# Altium schematic sheet Atmega-SolderingStation-v2.7_2025-10-03.schdoc
size 354 x 214 mm
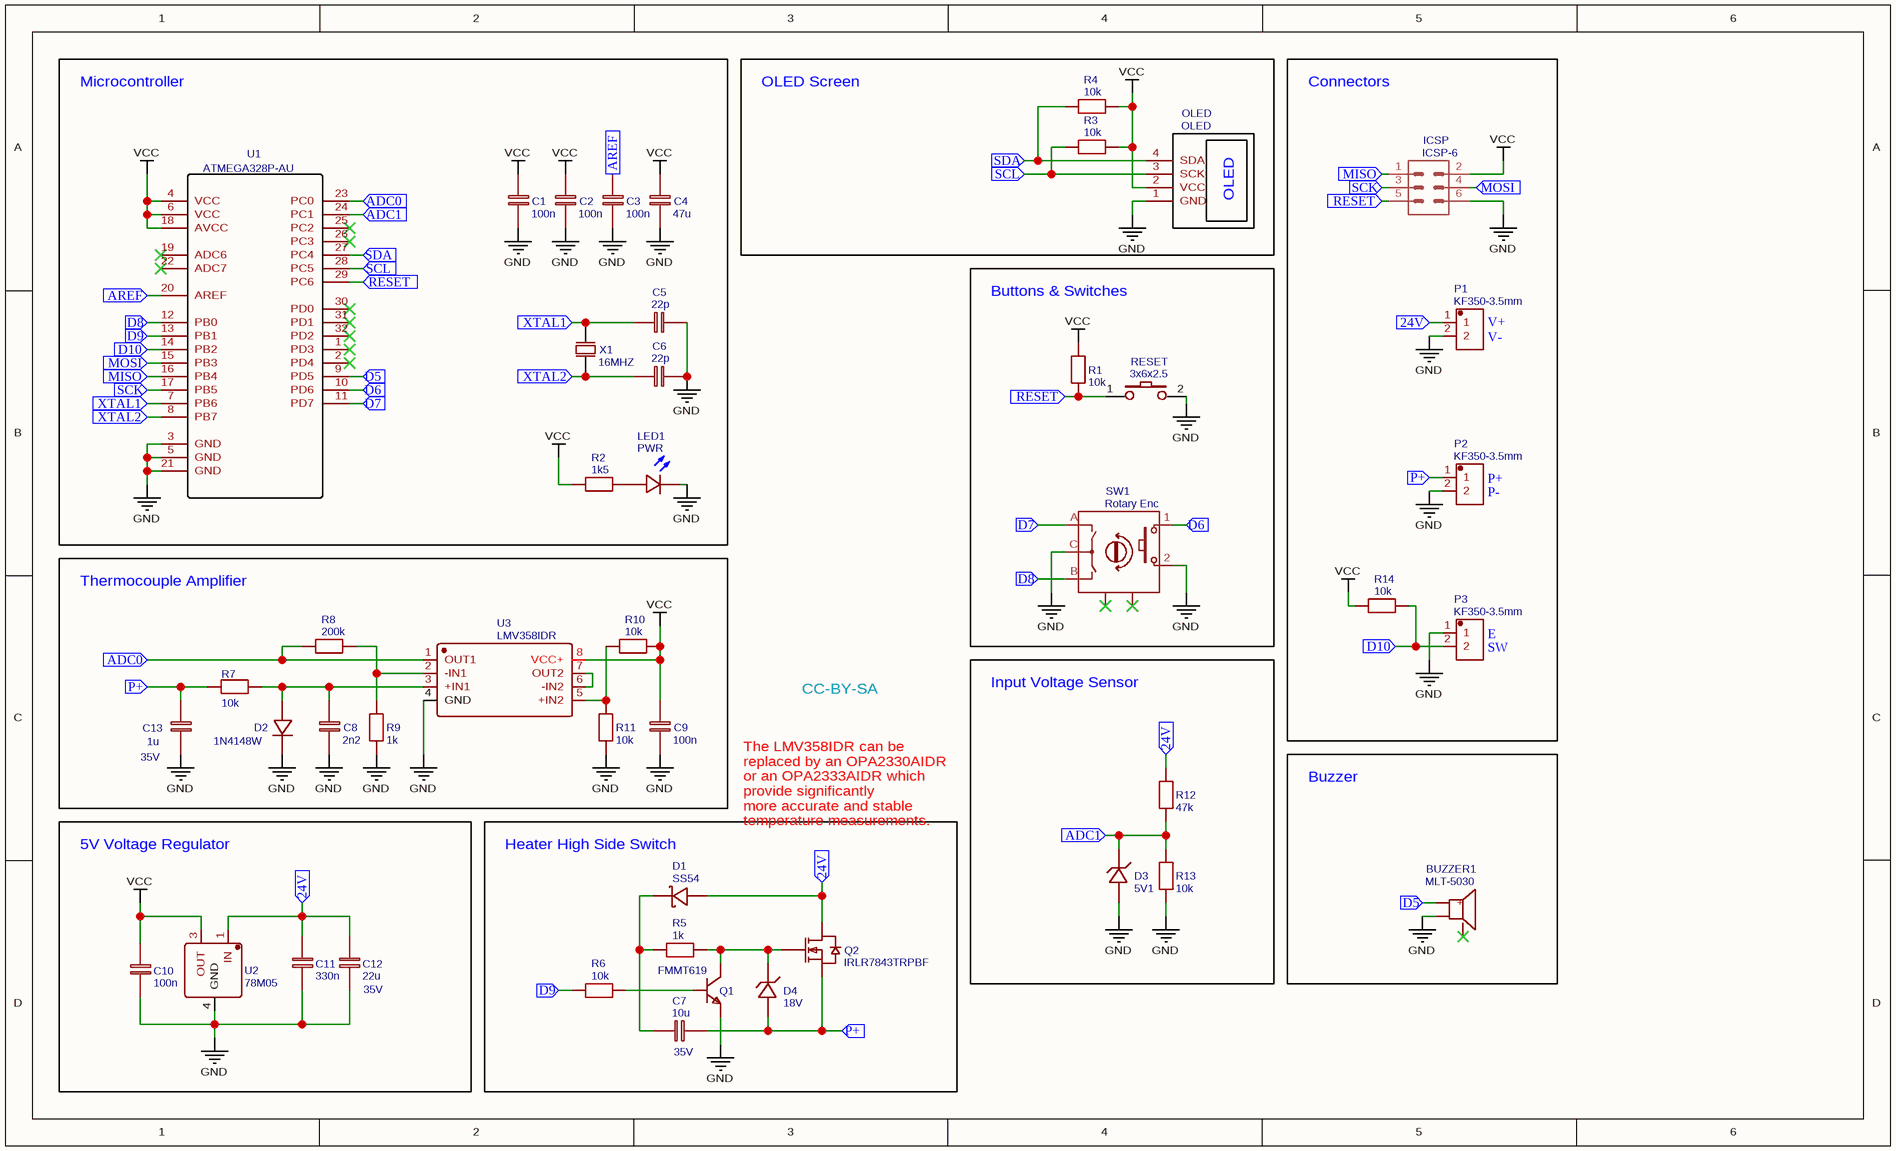
[diagram p0: Atmega-SolderingStation-v2.7_2025-10-03.schdoc]

## Parts
BUZZER1  MLT-5030  [MLT-5030]
C1  100n  [0603]
C2  100n  [0603]
C3  100n  [0603]
C4  47u  [1206]
C5  22p  [0603]
C6  22p  [0603]
C7  10u  [1206]
C8  2n2  [0603]
C9  100n  [0603]
C10  100n  [0603]
C11  330n  [0603]
C12  22u  [1206]
C13  1u  [0603]
D1  SS54  [DIODE-SMA(DO-214AC)]
D2  1N4148W  [DIODE-SOD-123]
D3  5V1  [ZENER-SOD-123]
D4  18V  [ZENER-SOD-123]
ICSP  ICSP-6  [ICSP-6]
LED1  PWR  [LED0603]
OLED  OLED  [I2C - OLED 0.96" 128X64]
P1  KF350-3.5mm  [KF350-2P]
P2  KF350-3.5mm  [KF350-2P]
P3  KF350-3.5mm  [KF350-2P]
Q1  FMMT619  [SOT-23-3_L2.9-W1.6-P1.90-LS2.8-BR]
Q2  IRLR7843TRPBF  [TO-252-2]
R1  10k  [0603]
R2  1k5  [0603]
R3  10k  [0603]
R4  10k  [0603]
R5  1k  [1206]
R6  10k  [0603]
R7  10k  [0603]
R8  200k  [0603]
R9  1k  [0603]
R10  10k  [0603]
R11  10k  [0603]
R12  47k  [0603]
R13  10k  [0603]
R14  10k  [0603]
RESET  3x6x2.5  [KEY-3.0*6.0]
SW1  Rotary Enc  [BOURNS_PEC11R-4XXXF-SXXXX]
U1  ATMEGA328P-AU  [TQFP-32_7X7X08P]
U2  78M05  [TO-252-2]
U3  LMV358IDR  [SOP-8_150MIL]
X1  16MHZ  [HC-49S]

## Blocks framed on the sheet
Microcontroller: C1-C6 LED1 R2 U1 X1
OLED Screen: OLED R3 R4
Connectors: ICSP P1-P3 R14
Buttons & Switches: R1 RESET SW1
Thermocouple Amplifier: C8 C9 C13 D2 R7-R11 U3
Input Voltage Sensor: D3 R12 R13
Buzzer: BUZZER1
5V Voltage Regulator: C10-C12 U2
Heater High Side Switch: C7 D1 D4 Q1 Q2 R5 R6

## Ports
24V (in), ADC0 (in), ADC1 (in), AREF (in), D5 (in), D6 (in), D7 (in), D8 (in), D9 (in), D10 (in), MISO (in), MOSI (in), P+ (in), RESET (in), SCK (in), SCL (in), SDA (in), XTAL1 (in), XTAL2 (in)

## Nets
GND: BUZZER1.2 C1.2 C2.2 C3.2 C4.2 C5.2 C6.2 C8.2 C9.2 C10.2 C11.2 C12.2 C13.2 D2.2(K) D3.1(A) ICSP.6 LED1.2(-) OLED.1(GND) P1.2 P2.2 P3.1 Q1.2(E) R9.1 R11.1 R13.1 RESET.2 SW1.2 SW1.C U1.3(GND) U1.5(GND) U1.21(GND) U2.4(GND) U3.4(GND)
VCC: C1.1 C2.1 C4.1 C9.1 C10.1 ICSP.2 OLED.2(VCC) R1.2 R2.1 R3.2 R4.1 R10.2 R14.1 U1.4(VCC) U1.6(VCC) U1.18(AVCC) U2.3(OUT) U3.8(VCC+)
24V: C11.1 C12.1 D1.1(A) P1.1 Q2.4(D) R12.2 U2.1(IN) ; port 24V
ADC0: R8.1 U1.23(PC0) U3.1(OUT1) ; port ADC0
ADC1: D3.2(K) R12.1 R13.2 U1.24(PC1) ; port ADC1
AREF: C3.1 U1.20(AREF) ; port AREF
D5: BUZZER1.1(+) U1.9(PD5) ; port D5
D6: SW1.1 U1.10(PD6) ; port D6
D7: SW1.A U1.11(PD7) ; port D7
D8: SW1.B U1.12(PB0) ; port D8
D9: R6.1 U1.13(PB1) ; port D9
D10: P3.2 R14.2 U1.14(PB2) ; port D10
MISO: ICSP.1 U1.16(PB4) ; port MISO
MOSI: ICSP.4 U1.15(PB3) ; port MOSI
P+: C7.2 C13.1 D4.1(A) P2.1 Q2.3(S) R7.1 ; port P+
RESET: ICSP.5 R1.1 RESET.1 U1.29(PC6) ; port RESET
SCK: ICSP.3 U1.17(PB5) ; port SCK
SCL: OLED.3(SCK) R3.1 U1.28(PC5) ; port SCL
SDA: OLED.4(SDA) R4.2 U1.27(PC4) ; port SDA
XTAL1: C5.1 U1.7(PB6) X1.2(OSC2) ; port XTAL1
XTAL2: C6.1 U1.8(PB7) X1.1(OSC1) ; port XTAL2
NetC7_1: C7.1 D1.2(K) R5.1
NetC8_1: C8.1 D2.1(A) R7.2 U3.3(+IN1)
NetD4_2: D4.2(K) Q1.3(C) Q2.1(G) R5.2
NetLED1_1: LED1.1(+) R2.2
NetQ1_1: Q1.1(B) R6.2
NetR8_2: R8.2 R9.2 U3.2(-IN1)
NetR10_1: R10.1 R11.2 U3.5(+IN2)
NetU3_6: U3.6(-IN2) U3.7(OUT2)

Not connected (* = marked no-connect by the designer): BUZZER1 3(NC)*; SW1 MT1* MT2*; U1 1(PD3)* 2(PD4)* 19(ADC6)* 22(ADC7)* 25(PC2)* 26(PC3)* 30(PD0)* 31(PD1)* 32(PD2)*

## Notes on the sheet
- (near P1) V+
- (near P1) V-
- (near P2) P+
- (near P2) P-
- CC-BY-SA
- (near P3) E
- (near P3) SW
- (near C13) 35V
- The LMV358IDR can be
  replaced by an OPA2330AIDR
  or an OPA2333AIDR which
  provide significantly
  more accurate and stable
  temperature measurements.
- (near C12) 35V
- (near C7) 35V

## Library data of the parts
BUZZER1 = MLT-5030: Manufacturer: HNDZ; Supplier: LCSC; Manufacturer Part: MLT-5030; Supplier Part: C95297; spicePre: B
C1-C3 C9 C10 = 100n: Manufacturer Part: CC0603KRX7R9BB104; Manufacturer: YAGEO; nameAlias: Value(F); spicePre: C; spiceSymbolName: Cap_0603_EU; Supplier: LCSC; Supplier Part: C14663
C4 = 47u: Manufacturer Part: 1206F476M100NT; Manufacturer: FH; nameAlias: Value(F); spicePre: C; spiceSymbolName: Cap_1206_EU; Supplier: LCSC; Supplier Part: C30349
C5 C6 = 22p: Manufacturer Part: CL10C220JB8NNNC; Manufacturer: SAMSUNG; nameAlias: Value(F); spicePre: C; spiceSymbolName: Cap_0603_EU; Supplier: LCSC; Supplier Part: C1653
C7 = 10u: Manufacturer Part: GMK316BJ106KL-T; Manufacturer: Taiyo Yuden; nameAlias: Value(F); spicePre: C; spiceSymbolName: Cap_1206_EU; Supplier: LCSC; Supplier Part: C92797
C8 = 2n2: Manufacturer Part: 0603B222K500NT; Manufacturer: FH; nameAlias: Value(F); spicePre: C; spiceSymbolName: Cap_0603_EU; Supplier: LCSC; Supplier Part: C1604
C11 = 330n: Manufacturer Part: C1608X7R1H334KT000E; Manufacturer: TDK; nameAlias: Value(F); spicePre: C; spiceSymbolName: Cap_0603_EU; Supplier: LCSC; Supplier Part: C76621
C12 = 22u: Manufacturer Part: C3216X5R1V226MTJ00E; Manufacturer: TDK; nameAlias: Value(F); spicePre: C; spiceSymbolName: Cap_1206_EU; Supplier: LCSC; Supplier Part: C342620
C13 = 1u: Manufacturer Part: CL10A105KB8NNNC; Manufacturer: SAMSUNG; nameAlias: Value(F); spicePre: C; spiceSymbolName: Cap_0603_EU; Supplier: LCSC; Supplier Part: C15849
D1 = SS54: Manufacturer: Jingdao; Contributor: LCSC; SMT Type: Extend; Supplier: LCSC; Supplier Part: C123946; Manufacturer Part: SS54; LCSC Assembly: Yes; spicePre: D; spiceSymbolName: SS54_C123946
D2 = 1N4148W: Manufacturer: Vishay Intertech; Manufacturer Part: 1N4148W-E3-08; Contributor: LCSC; Supplier: LCSC; Supplier Part: C241939; spicePre: D
D3 = 5V1: Manufacturer: SEMTECH; Manufacturer Part: MM1Z5V1; Contributor: LCSC; SMT Type: Extend; Supplier: LCSC; Supplier Part: C81601; LCSC Assembly: Yes; spicePre: D
D4 = 18V: Manufacturer: Jingdao; Manufacturer Part: MM1Z18; Contributor: LCSC; SMT Type: Extend; Supplier: LCSC; Supplier Part: C116111; LCSC Assembly: Yes; spicePre: D
ICSP = ICSP-6: Contributor: DowntownCB; Manufacturer Part: ?; spicePre: J
LED1 = PWR: Manufacturer: EVERLIGHT; Manufacturer Part: 19-217/BHC-ZL1M2RY/3T; Supplier: LCSC; Supplier Part: C72041; spicePre: L
OLED = OLED: Manufacturer Part: SSD1306 I2C OLED; Contributor: stozk; spicePre: U
P1-P3 = KF350-3.5mm: Manufacturer: ReliaPro; Manufacturer Part: WJ2EDGVC-5.08-2P; spicePre: X; Supplier Part: C8445; Supplier: LCSC
Q1 = FMMT619: Manufacturer: CJ; SMT Type: Extend; Supplier: LCSC; Manufacturer Part: FMMT619; Supplier Part: C53071; LCSC Assembly: Yes; spicePre: Q; spiceSymbolName: MMBTA06 1GM
Q2 = IRLR7843TRPBF: Manufacturer: IR; SMT Type: Extend; Supplier: LCSC; Manufacturer Part: IRLR7843TRPBF; image: //image.lceda.cn/szlcsc/C21988.jpg; Supplier Part: C21988; LCSC Assembly: Yes; spicePre: Q
R1 R3 R4 R6 R7 R10 R11 R13 R14 = 10k: Manufacturer Part: 0603WAF1002T5E; Manufacturer: UniOhm; nameAlias: Value(Ω); spicePre: R; spiceSymbolName: Res_0603(1/10W)_EU; Supplier: LCSC; Supplier Part: C25804
R2 = 1k5: Manufacturer Part: 0603WAF1501T5E; Manufacturer: UniOhm; nameAlias: Value(Ω); spicePre: R; spiceSymbolName: Res_0603(1/10W)_EU; Supplier: LCSC; Supplier Part: C22843
R5 = 1k: Manufacturer Part: 1206W4F1001T5E; Manufacturer: UniOhm; nameAlias: Value(Ω); spicePre: R; spiceSymbolName: Res_1206(1/4W)_EU; Supplier: LCSC; Supplier Part: C4410
R8 = 200k: Manufacturer Part: 0603WAF2003T5E; Manufacturer: UniOhm; nameAlias: Value(Ω); spicePre: R; spiceSymbolName: Res_0603(1/10W)_EU; Supplier: LCSC; Supplier Part: C25811
R9 = 1k: Manufacturer Part: 0603WAF1001T5E; Manufacturer: UniOhm; nameAlias: Value(Ω); spicePre: R; spiceSymbolName: Res_0603(1/10W)_EU; Supplier: LCSC; Supplier Part: C21190
R12 = 47k: Manufacturer Part: 0603WAF4702T5E; Manufacturer: UniOhm; nameAlias: Value(Ω); spicePre: R; spiceSymbolName: Res_0603(1/10W)_EU; Supplier: LCSC; Supplier Part: C25819
RESET = 3x6x2.5: Manufacturer: ReliaPro; Manufacturer Part: 3x6x2.5Red head high temperature; Supplier Part: C46491; Supplier: LCSC; image: http://image.lceda.cn/szlcsc/C46491.jpg; spicePre: K
SW1 = Rotary Enc: Manufacturer: BOURNS; Manufacturer Part: PEC11R-4015F-S0024; Contributor: LCSC; Supplier: LCSC; Supplier Part: C143789; spicePre: S
U1 = ATMEGA328P-AU: Manufacturer: MICROCHIP; SMT Type: Extend; Supplier: LCSC; Manufacturer Part: ATMEGA328P-AU; image: //image.lceda.cn/szlcsc/C14877.jpg; Supplier Part: C14877; LCSC Assembly: Yes; spicePre: U
U2 = 78M05: Manufacturer: MICRONE; Manufacturer Part: ME78M05K3G; SMT Type: Extend; Supplier: LCSC; image: //image.lceda.cn/szlcsc/C83969.jpg; Supplier Part: C83969; LCSC Assembly: Yes; spicePre: U
U3 = LMV358IDR: Manufacturer: TI; SMT Type: Extend; Supplier: LCSC; Manufacturer Part: LMV358IDR; Supplier Part: C63813; LCSC Assembly: Yes; spicePre: U
X1 = 16MHZ: Manufacturer: Yangxing Tech; Manufacturer Part: X49SD16MSD2SI; nameAlias: Frequency; Contributor: LCSC; Supplier: LCSC; Supplier Part: C188201; spicePre: X; spiceSymbolName: X49SD16MSD2SI